# Altium schematic sheet dps.SchDoc
size A4
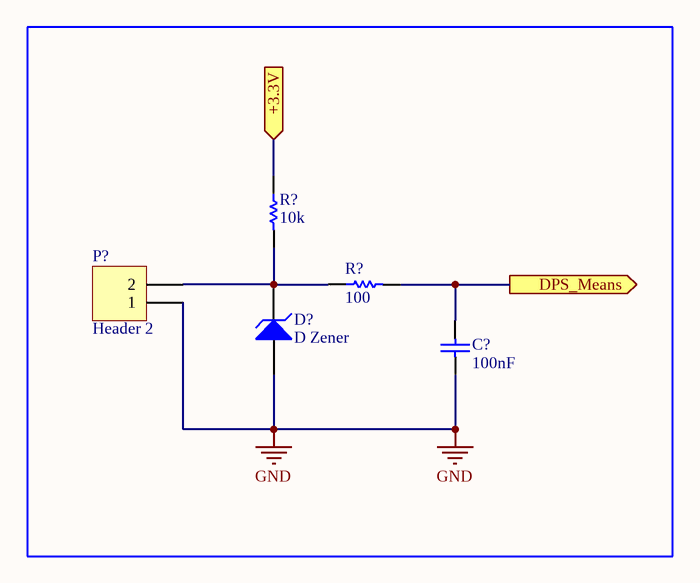
[diagram p0: dps.SchDoc]

## Parts
(Parts that share a designator on the sheet are numbered #1, #2 ... from top to bottom, then left to right.)
C?  100nF  [C0603[0201]]
D?  D Zener  [DIODE-SIGNAL]
P?  Header 2  [HDR1X2]
R?#1  10k  [R1608[0603]]
R?#2  100  [R1608[0603]]

## Ports
+3.3V (in), DPS_Means (out)

## Nets
GND: C?.1 D?.1(A) P?.1
+3.3V: R?#1.1 ; port +3.3V
DPS_Means: C?.2 R?#2.2 ; port DPS_Means
NetD?_2: D?.2(K) P?.2 R?#1.2 R?#2.1

## Notes on the sheet
- Title
- Size:
- Date:
- A4
- Author:
- Time:
- Sheet
- of
- File:

## Library data of the parts
C? = C: 贴片陶瓷电容 0.1uF ±10% 50V X7R 0603; Manufacturer Part Number: C0603C104K5RACTU; Value: 1; Dielectric Material: Ceramic; Dissipation Factor: 2.5%; Manufacturer: *; PartNumber: *; Package Type: *; Supplier 1: RSComponents; Supplier Part Number 1: 8015347; RoHS: Yes; Category: Ceramic Capacitors; Stock 1: 29000; Pricing 1: 1000=0,04900 (GBP); Mount: Surface Mount; Case/Package: 0603; Number of Pins: 2; Case Code (Metric): 1608; Case Code (Imperial): 0603; Contact Plating: Tin,Matte; Min Operating Temperature: -55°C; Max Operating Temperature: 125°C; Voltage Rating (DC): 50V; Tolerance: 10%; Voltage Rating: 50V; Packaging: Tape and Reel; Termination: SMD/SMT; Capacitance: 100nF; Package Quantity: 1; Dielectric: X7R; Series: SMD Comm X7R; Voltage: 50V; Length: 0.063inch; Width: 0.031inch; Height: 0.8mm; Depth: 0.8mm; Thickness: 0.034inch; Lead Pitch: 0.7mm; Radiation Hardening: No; REACH SVHC: No SVHC; RoHS Compliant: Yes
D? = D Zener: Zener Diode; Manufacturer: *; PartNumber: *; Package Type: *
P? = Header 2: 间距5.08mm 2pin 母座 12A 320V 弯插 封边; Manufacturer: Phoenix Contact; Manufacturer Part Number: 1757242; Number of Positions: 2; Voltage Rating: 250V; Connector Type: Plug; Gender: Male; Number of Levels: 1; Current: 15A; Voltage: 300V; Pitch: 5.08mm; Approvals: UL,CSA,VDE,EN; LatestRevisionDate: 17-Jul-2002; LatestRevisionNote: Re-released for DXP Platform.; Publisher: Altium Limited; Supplier 1: RSComponents; Supplier Part Number 1: 1896105; RoHS: Yes; Category: Terminal Blocks; Stock 1: 1395; Pricing 1: 5=0,48800, 75=0,44200, 250=0,40400, 500=0,36600, 1000=0,34200 (GBP); Mount: Through Hole; Contact Plating: Tin; Color: Grey,Green; Housing Material: PBT; Contact Material: Tin; Housing Color: Green; Weight: 5.396916oz; Number of Rows: 1; Package Quantity: 50; Packaging: Bulk; Termination: Solder; Number of Contacts: 2; Orientation: Right Angle; Series: MSTBA; Current Rating: 12A; Voltage Rating (DC): 320V; Max Current Rating: 12A; Number of Poles: 2; Number of Positions Per Level: 2; Length: 12.16mm; Width: 12.1mm; Height: 12.08mm; Depth: 12mm; Flammability Rating: UL94 V-0; RoHS Compliant: Yes; REACH SVHC: No SVHC; Lead Free: Lead Free; ComponentLink1URL: https://datasheet.ciiva.com/16096/1757242-16096402.pdf?src-supplier=Onlinecomponents.com; ComponentLink1Description: https://datasheet.ciiva.com/16096/1757242-16096402.pdf?src-supplier=Onlinecomponents.com; ComponentLink2URL: https://datasheet.ciiva.com/15197/getdatasheetpartid-176350-15197328.pdf?src-supplier=Verical; ComponentLink2Description: https://datasheet.ciiva.com/15197/getdatasheetpartid-176350-15197328.pdf?src-supplier=Verical; ComponentLink3URL: https://datasheet.ciiva.com/795/1757242-795407.pdf?src-supplier=Digi-Key; ComponentLink3Description: https://datasheet.ciiva.com/795/1757242-795407.pdf?src-supplier=Digi-Key; ComponentLink4URL: https://datasheet.ciiva.com/29210/569017-da-01-en-grundgehaeuse-1757242-250-st-29210285.pdf?src-supplier=Conrad; ComponentLink4Description: https://datasheet.ciiva.com/29210/569017-da-01-en-grundgehaeuse-1757242-250-st-29210285.pdf?src-supplier=Conrad; ComponentLink5URL: https://datasheet.ciiva.com/7630/100955-7630839.pdf?src-supplier=Element14; ComponentLink5Description: https://datasheet.ciiva.com/7630/100955-7630839.pdf?src-supplier=Element14; ComponentLink6URL: https://datasheet.ciiva.com/33105/1757242-33105868.pdf?src-supplier=Today+Components; ComponentLink6Description: https://datasheet.ciiva.com/33105/1757242-33105868.pdf?src-supplier=Today+Components
R?#1 R?#2 = R: Res, 10K, 0.01%, 0.25W, 1206, Metal Foil; Manufacturer Part Number: Y163010K0000T9R; Value: 0; Resistance: 10kR; Max Power Dissipation: 250mW; Temperature Coefficient: 0.2ppm/°C; Manufacturer: *; PartNumber: *; Package Type: *; Supplier 1: Digi-Key; Supplier Part Number 1: Y1630-10.0KBCT-ND; RoHS: Yes; Category: Chip SMD Resistors; Stock 1: 1437; Pricing 1: 1=11,40000, 10=10,36300, 25=9,32640, 50=8,03100, 100=7,38340 (USD); Case/Package: 1206; Case Code (Metric): 3216; Case Code (Imperial): 1206; Min Operating Temperature: -55°C; Max Operating Temperature: 150°C; Package Quantity: 1; Packaging: Tape and Reel; Tolerance: 0.01%; Resistor Type: Metal Foil; Number of Terminations: 2; Features: Moisture Resistant,Anti-Sulfur; Length: 0.126inch; Width: 0.062inch; Height: 0.025inch; RoHS Compliant: Yes; ComponentLink1URL: https://datasheet.ciiva.com/29711/vfcpseri-29711161.pdf?src-supplier=Digi-Key; ComponentLink1Description: https://datasheet.ciiva.com/29711/vfcpseri-29711161.pdf?src-supplier=Digi-Key; ComponentLink2URL: https://datasheet.ciiva.com/29711/vfcpseri-29711162.pdf?src-supplier=Digi-Key; ComponentLink2Description: https://datasheet.ciiva.com/29711/vfcpseri-29711162.pdf?src-supplier=Digi-Key; ComponentLink3URL: https://datasheet.ciiva.com/18610/vfcpseri-18610015.pdf?src-supplier=Digi-Key; ComponentLink3Description: https://datasheet.ciiva.com/18610/vfcpseri-18610015.pdf?src-supplier=Digi-Key